# EAGLE design pj13 (EAGLE 7.4.0)
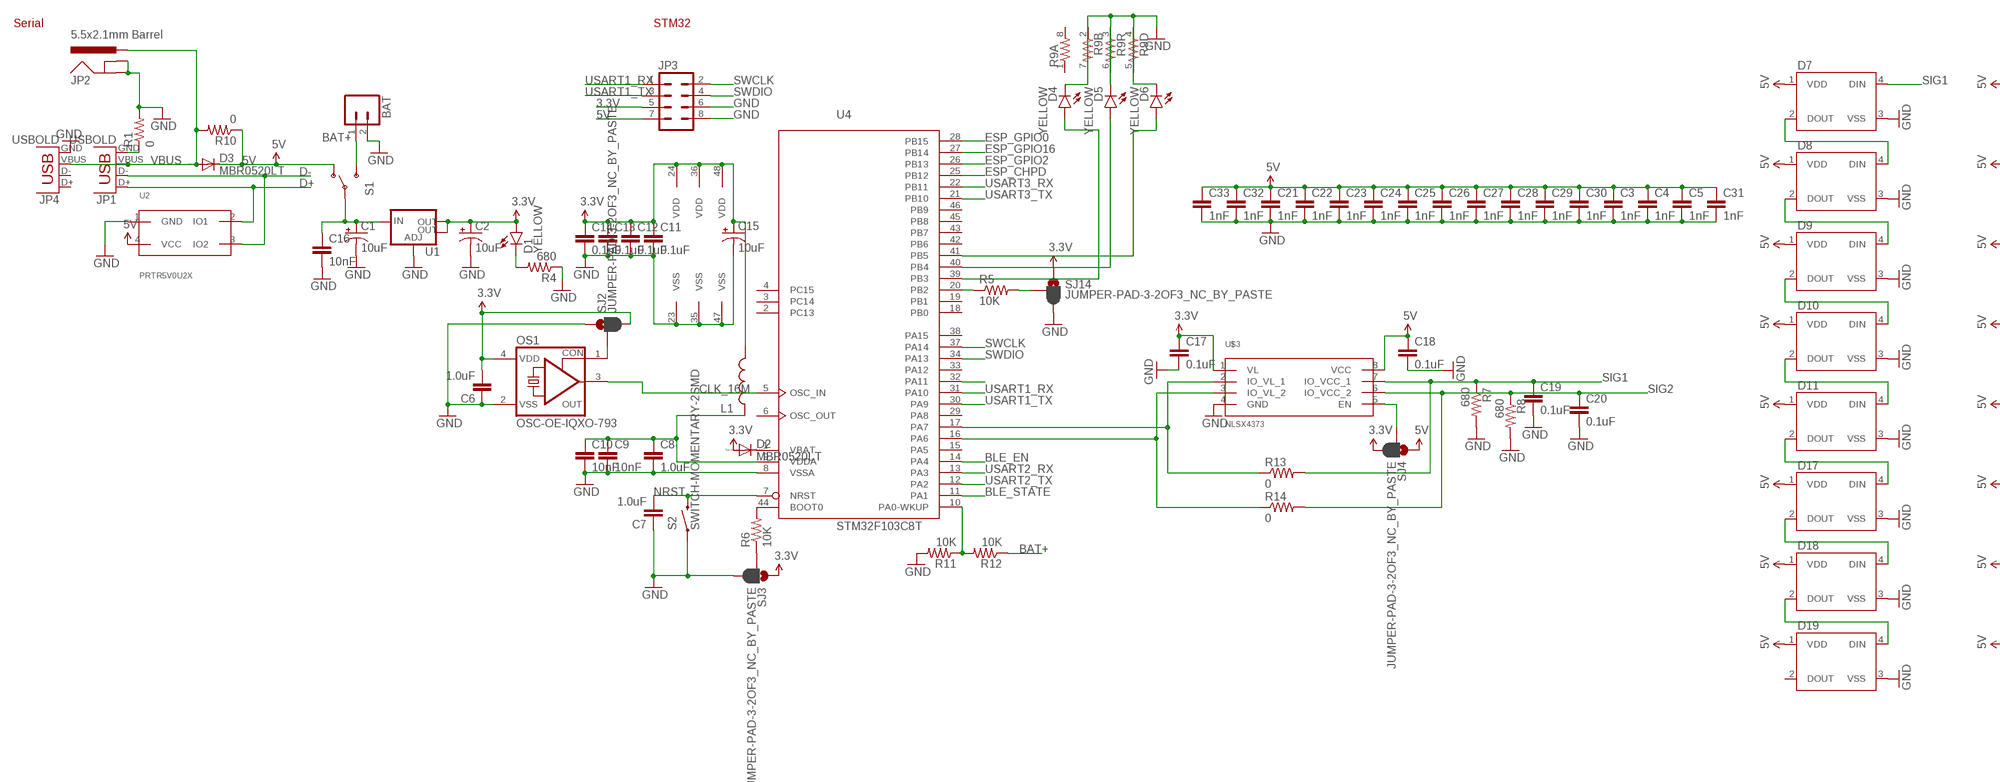
[diagram p0: schematic, sheet 1, part 1 of 2]
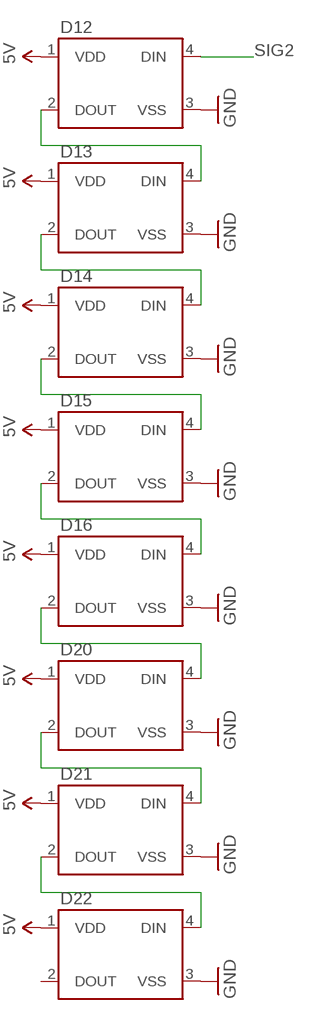
[diagram p1: schematic, sheet 1, part 2 of 2]

## Parts
BAT  M02LOCK  [1X02_LOCK]
C1  10uF  10UF-16V-10%(TANT)  [EIA3216]
C2  10uF  10UF-16V-10%(TANT)  [EIA3216]
C3  1nF  0.1UF-25V-5%(0603)  [0603-CAP]
C4  1nF  0.1UF-25V-5%(0603)  [0603-CAP]
C5  1nF  0.1UF-25V-5%(0603)  [0603-CAP]
C6  1.0uF  1.0UF-16V-10%(0603)  [0603-CAP]
C7  1.0uF  1.0UF-16V-10%(0603)  [0603-CAP]
C8  1.0uF  1.0UF-16V-10%(0603)  [0603-CAP]
C9  10nF  10NF/10000PF-50V-10%(0603)  [0603-CAP]
C10  10nF  10NF/10000PF-50V-10%(0603)  [0603-CAP]
C11  0.1uF  0.1UF-25V-5%(0603)  [0603-CAP]
C12  0.1uF  0.1UF-25V-5%(0603)  [0603-CAP]
C13  0.1uF  0.1UF-25V-5%(0603)  [0603-CAP]
C14  0.1uF  0.1UF-25V-5%(0603)  [0603-CAP]
C15  10uF  10UF-16V-10%(TANT)  [EIA3216]
C16  10nF  10NF/10000PF-50V-10%(0603)  [0603-CAP]
C17  0.1uF  0.1UF-25V-5%(0603)  [0603-CAP]
C18  0.1uF  0.1UF-25V-5%(0603)  [0603-CAP]
C19  0.1uF  0.1UF-25V-5%(0603)  [0603-CAP]
C20  0.1uF  0.1UF-25V-5%(0603)  [0603-CAP]
C21  1nF  0.1UF-25V-5%(0603)  [0603-CAP]
C22  1nF  0.1UF-25V-5%(0603)  [0603-CAP]
C23  1nF  0.1UF-25V-5%(0603)  [0603-CAP]
C24  1nF  0.1UF-25V-5%(0603)  [0603-CAP]
C25  1nF  0.1UF-25V-5%(0603)  [0603-CAP]
C26  1nF  0.1UF-25V-5%(0603)  [0603-CAP]
C27  1nF  0.1UF-25V-5%(0603)  [0603-CAP]
C28  1nF  0.1UF-25V-5%(0603)  [0603-CAP]
C29  1nF  0.1UF-25V-5%(0603)  [0603-CAP]
C30  1nF  0.1UF-25V-5%(0603)  [0603-CAP]
C31  1nF  0.1UF-25V-5%(0603)  [0603-CAP]
C32  1nF  0.1UF-25V-5%(0603)  [0603-CAP]
C33  1nF  0.1UF-25V-5%(0603)  [0603-CAP]
D1  YELLOW  LED-YELLOW1206  [LED-1206]
D2  MBR0520LT  [SOD123]
D3  MBR0520LT  [SOD123]
D4  YELLOW  LED-YELLOW1206  [LED-1206]
D5  YELLOW  LED-YELLOW1206  [LED-1206]
D6  YELLOW  LED-YELLOW1206  [LED-1206]
D7  WS2812B  [WS2812B]
D8  WS2812B  [WS2812B]
D9  WS2812B  [WS2812B]
D10  WS2812B  [WS2812B]
D11  WS2812B  [WS2812B]
D12  WS2812B  [WS2812B]
D13  WS2812B  [WS2812B]
D14  WS2812B  [WS2812B]
D15  WS2812B  [WS2812B]
D16  WS2812B  [WS2812B]
D17  WS2812B  [WS2812B]
D18  WS2812B  [WS2812B]
D19  WS2812B  [WS2812B]
D20  WS2812B  [WS2812B]
D21  WS2812B  [WS2812B]
D22  WS2812B  [WS2812B]
JP1  USBOLD  [USB-MINIB-OLD]
JP2  5.5x2.1mm Barrel  POWER_JACKSMD  [POWER_JACK_SMD]
JP3  M04X2SMD  [2X4_SMD]
JP4  USBOLD  [USB-MINIB-OLD]
L1  INDUCTOR0603  [0603]
OS1  OSC-OE-IQXO-793  [2.5X2-4-PAD]
R1  0  0OHM-1/10W-5%(0603)  [0603]
R4  680  680OHM1/10W5%(0603)  [0603-RES]
R5  10K  10KOHM-1/10W-1%(0603)0603  [0603-RES]
R6  10K  10KOHM-1/10W-1%(0603)0603  [0603-RES]
R7  680  680OHM1/10W5%(0603)  [0603-RES]
R8  680  680OHM1/10W5%(0603)  [0603-RES]
R9  RESISTOR-ARRAY0603-ARV  [0603-ARV]
R10  0  0OHM-1/10W-5%(0603)  [0603]
R11  10K  10KOHM-1/10W-1%(0603)0603  [0603-RES]
R12  10K  10KOHM-1/10W-1%(0603)0603  [0603-RES]
R13  0  680OHM1/10W5%(0603)  [0603-RES]
R14  0  680OHM1/10W5%(0603)  [0603-RES]
S1  SWITCH-SPDTSMD  [AYZ0202]
S2  SWITCH-MOMENTARY-2SMD  [TACTILE-SWITCH-SMD]
SJ2  JUMPER-PAD-3-2OF3_NC_BY_PASTE  [PAD-JUMPER-3-2OF3_NC_BY_PASTE_YES_SILK_FULL_BOX]
SJ3  JUMPER-PAD-3-2OF3_NC_BY_PASTE  [PAD-JUMPER-3-2OF3_NC_BY_PASTE_YES_SILK_FULL_BOX]
SJ4  JUMPER-PAD-3-2OF3_NC_BY_PASTE  [PAD-JUMPER-3-2OF3_NC_BY_PASTE_YES_SILK_FULL_BOX]
SJ14  JUMPER-PAD-3-2OF3_NC_BY_PASTE  [PAD-JUMPER-3-2OF3_NC_BY_PASTE_YES_SILK_FULL_BOX]
U1  V_REG_LM1117SOT223  [SOT223]
U2  PRTR5V0U2X  [SOT143]
U4  STM32F103C8T  [LQFP48]
U$3  NLSX4373  [SO08]

## Nets
3.3V: C2.A(+) C6.2 C11.1 C12.1 C13.1 C14.1 C15.A(+) C17.1 D1.A D2.A JP3.5 L1.2 OS1.4(VDD) SJ2.3 SJ3.1 SJ4.3 SJ14.1 U1.2(OUT) U1.4(OUT) U4.24(VDD) U4.36(VDD) U4.48(VDD) U$3.1(VL)
5V: C3.1 C4.1 C5.1 C18.1 C21.1 C22.1 C23.1 C24.1 C25.1 C26.1 C27.1 C28.1 C29.1 C30.1 C31.1 C32.1 C33.1 D3.C D7.1(VDD) D8.1(VDD) D9.1(VDD) D10.1(VDD) D11.1(VDD) D12.1(VDD) D13.1(VDD) D14.1(VDD) D15.1(VDD) D16.1(VDD) D17.1(VDD) D18.1(VDD) D19.1(VDD) D20.1(VDD) D21.1(VDD) D22.1(VDD) JP3.7 R10.1 S1.1(O) SJ4.1 U2.4(VCC) U$3.8(VCC)
BAT+: BAT.1 R12.1 S1.3(S)
BLE_EN: U4.14(PA4)
BLE_STATE: U4.11(PA1)
CLK_16M: OS1.3(OUT) U4.5(OSC_IN)
D+: JP1.D+ U2.2(IO1)
D-: JP1.D- U2.3(IO2)
ESP_CHPD: U4.25(PB12)
ESP_GPIO0: U4.28(PB15)
ESP_GPIO2: U4.26(PB13)
ESP_GPIO16: U4.27(PB14)
GND: BAT.2 C1.C(-) C2.C(-) C3.2 C4.2 C5.2 C6.1 C7.1 C8.2 C9.2 C10.2 C11.2 C12.2 C13.2 C14.2 C15.C(-) C16.2 C17.2 C18.2 C19.2 C20.2 C21.2 C22.2 C23.2 C24.2 C25.2 C26.2 C27.2 C28.2 C29.2 C30.2 C31.2 C32.2 C33.2 D7.3(VSS) D8.3(VSS) D9.3(VSS) D10.3(VSS) D11.3(VSS) D12.3(VSS) D13.3(VSS) D14.3(VSS) D15.3(VSS) D16.3(VSS) D17.3(VSS) D18.3(VSS) D19.3(VSS) D20.3(VSS) D21.3(VSS) D22.3(VSS) JP2.GND(GNDBREAK) JP2.P$4(GND) JP3.6 JP3.8 JP4.GND OS1.2(VSS) R1.2 R4.1 R7.2 R8.2 R9.5 R9.6 R9.7 R11.2 S2.1 SJ2.1 SJ3.3 SJ14.3 U1.1(ADJ) U2.1(GND) U4.8(VSSA) U4.23(VSS) U4.35(VSS) U4.47(VSS) U$3.4(GND)
N$1: JP1.GND R1.1
N$2: D11.2(DOUT) D17.4(DIN)
N$3: D1.C R4.2
N$4: D2.C U4.1(VBAT)
N$5: R11.1 R12.2 U4.10(PA0-WKUP)
N$6: C8.1 C9.1 C10.1 L1.1 U4.9(VDDA)
N$7: R6.2 U4.44(BOOT0)
N$8: D6.A U4.41(PB5)
N$9: R6.1 SJ3.2
N$10: D17.2(DOUT) D18.4(DIN)
N$11: OS1.1(CON) SJ2.2
N$13: D5.A U4.40(PB4)
N$14: SJ4.2 U$3.5(EN)
N$15: D18.2(DOUT) D19.4(DIN)
N$16: D4.A U4.39(PB3)
N$17: D4.C R9.2
N$18: D5.C R9.3
N$19: D6.C R9.4
N$20: C1.A(+) C16.1 S1.2(P) U1.3(IN)
N$24: D12.2(DOUT) D13.4(DIN)
N$25: D13.2(DOUT) D14.4(DIN)
N$26: R13.1 U4.17(PA7) U$3.2(IO_VL_1)
N$27: R14.1 U4.16(PA6) U$3.3(IO_VL_2)
N$28: D7.2(DOUT) D8.4(DIN)
N$29: D8.2(DOUT) D9.4(DIN)
N$30: D9.2(DOUT) D10.4(DIN)
N$31: D10.2(DOUT) D11.4(DIN)
N$32: D14.2(DOUT) D15.4(DIN)
N$33: D15.2(DOUT) D16.4(DIN)
N$34: D16.2(DOUT) D20.4(DIN)
N$35: D20.2(DOUT) D21.4(DIN)
N$36: D21.2(DOUT) D22.4(DIN)
N$48: R5.2 SJ14.2
NRF_CSN: U4.32(PA11)
NRST: C7.2 S2.3 U4.7(NRST)
OURET: R5.1 U4.20(PB2)
SIG1: C19.1 D7.4(DIN) R7.1 R13.2 U$3.7(IO_VCC_1)
SIG2: C20.1 D12.4(DIN) R8.1 R14.2 U$3.6(IO_VCC_2)
SWCLK: JP3.2 U4.37(PA14)
SWDIO: JP3.4 U4.34(PA13)
USART1_RX: JP3.1 U4.31(PA10)
USART1_TX: JP3.3 U4.30(PA9)
USART2_RX: U4.13(PA3)
USART2_TX: U4.12(PA2)
USART3_RX: U4.22(PB11)
USART3_TX: U4.21(PB10)
VBUS: D3.A JP1.VBUS JP2.VIN0(PWR) JP4.VBUS R10.2
Unconnected: D19.2(DOUT) D22.2(DOUT) JP4.D+ JP4.D- R9.1 R9.8 U4.2(PC13) U4.3(PC14) U4.4(PC15) U4.6(OSC_OUT) U4.15(PA5) U4.18(PB0) U4.19(PB1) U4.29(PA8) U4.33(PA12) U4.38(PA15) U4.42(PB6) U4.43(PB7) U4.45(PB8) U4.46(PB9)

## Notes on the sheet
- Serial | STM32

## Library data of the parts
BAT = SparkFun-Connectors:M02: Standard 2-pin 0.1" header. Use with - straight break away headers ( PRT-00116) - right angle break away headers (PRT-00553) - swiss pins (PRT-00743) - machine pins (PRT-00117) - female headers (PRT-00115) Molex polarized connector foot print use with: PRT-08233 with associated crimp pins and housings. 2.54_SCREWTERM for use with PRT-10571. 3.5mm Screw Terminal footprints for PRT-08084 5mm Screw Terminal footprints for use with PRT-08432
C1 C2 C15 = SparkFun-Capacitors:10UF-16V-10%(TANT): CAP-00811 1206/EIA-3216 Tantalum capacitor; PROD_ID: CAP-00811
C3-C5 C21-C33 = SparkFun-Capacitors:0.1UF-25V-5%(0603): CAP-08604; PROD_ID: CAP-08604; VALUE: 0.1uF
C6-C8 = SparkFun-Capacitors:1.0UF-16V-10%(0603): CAP-00868; PROD_ID: CAP-00868
C9 C10 C16 = SparkFun-Capacitors:10NF/10000PF-50V-10%(0603): CAP-00867; PROD_ID: CAP-00867
C11-C14 C17-C20 = SparkFun-Capacitors:0.1UF-25V-5%(0603): CAP-08604; PROD_ID: CAP-08604
D1 D4-D6 = SparkFun-LED:LED-YELLOW: Yellow SMD LEDs LilyPad 1206- DIO-09909 0603- DIO-09003 "SMART" means more efficient and expensive; PROD_ID: DIO-00820
D2 D3 = diode:MBR0520LT: SCHOTTKY BARRIER RECTIFIER Source: http://onsemi.com .. MBR0520LT1-D.pdf
D7-D22 = SparkFun-LED:WS2812B: WS2812B - Intelligent control LED integrated light source Technical Specifications: Power Supply Voltage (VDD): 3.5 to 5.3 V Input Voltage (VI): -0.5 to VDD+0.5 V Operating Junction Temperature (Topt): -25°C to +80°C Storage Temperature Range (Tstg): -55°C to +150°C; PROD_ID: DIO-12503
JP1 JP4 = SparkFun-Connectors:USB: USB Connectors USB-B-PTH is fully proven SKU : PRT-00139/CONN-08278 USB-miniB is fully proven SKU : PRT-00587 USB-A-PCB is untested. USB-A-H is throughly reviewed, but untested. Spark Fun Electronics SKU : PRT-00437 USB-B-SMT is throughly reviewed, but untested. Needs silkscreen touching up. USB-A-S has not been used/tested USB-MB-H has not been used/tested USB-MICROB has been used. CONN-09505
JP2 = SparkFun-Connectors:POWER_JACK: Power Jack This is the standard 5.5mm barrel jack for power. The PTH is the most common, proven, reliable, footprint. The Slot footprint only works if the mill layer is transmitted to the PCB fab house so be warned. Mating wall wart : TOL-00298 (and others); PROD_ID: CONN-08106; SF_ID: PRT-12748
JP3 = SparkFun-Connectors:M04X2: .1" header, two rows of four.
L1 = SparkFun-Passives:INDUCTOR: Inductors Basic Inductor/Choke - 0603 and 1206. Footprints are not proven and vary greatly between part numbers. INDUCTOR POWER 3.3UH 4.0A SMD 0.197" L x 0.197" W x 0.177" H (5.00mm x 5.00mm x 4.50mm)
OS1 = IQD-Frequency-Products:OSC-OE: OSCILLATOR WITH OE
R1 R10 = SparkFun-Resistors:0OHM-1/10W-5%(0603): RES-08609; PROD_ID: RES-08609
R4 R7 R8 = SparkFun-Resistors:680OHM1/10W5%(0603): RES-09333; PROD_ID: RES-09333
R5 R6 R11 R12 = SparkFun-Resistors:10KOHM-1/10W-1%(0603): RES-00824; PROD_ID: RES-00824
R9 = SparkFun-Resistors:RESISTOR-ARRAY: Array Chip Resistor Source: RS Component / Phycomp
R13 R14 = SparkFun-Resistors:680OHM1/10W5%(0603): RES-09333; PROD_ID: RES-09333; VALUE: 680
S1 = SparkFun-Electromechanical:SWITCH-SPDT: SPDT Switch Simple slide switch, Spark Fun Electronics SKU : COM-00102 DPDT SMT slide switch, AYZ0202, SWCH-08179; PROD_ID: SWCH-08179; SF_ID: COM-00597
S2 = SparkFun-Electromechanical:SWITCH-MOMENTARY-2: Various NO switches- pushbuttons, reed, etc; PROD_ID: SWCH-08247
SJ2-SJ4 SJ14 = SparkFun-Passives:JUMPER-PAD-3-2OF3_NC_BY_PASTE
U1 = SparkFun-PowerIC:V_REG_LM1117: Voltage Regulator LM1117 Standard adjustable voltage regulator but in SMD form. Spark Fun Electronics SKU : COM-00595; PROD_ID: VREG-08170
U2 = semicon-smd-ipc:PRTR5V0U2X
U4 = micro-stm_v3:STM32F103C*T: ARM 32-bit Cortex™-M3 CPU 72 MHz maximum frequency 16 to 128 Kbytes of Flash memory 6 to 20 kbytes of SRAM 37 GPIOs 2.0 to 3.6 V application supply
U$3 = SparkFun-DigitalIC:NLSX4373

## Board
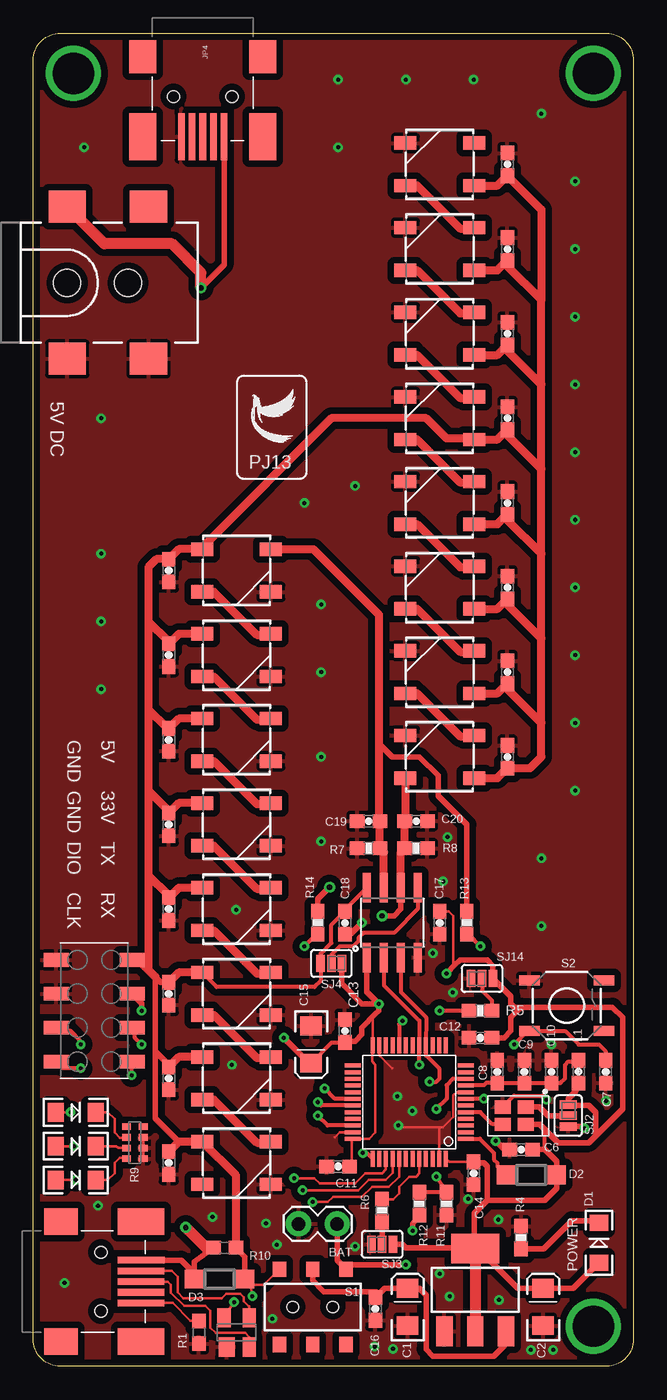
[diagram p2: board, top side]
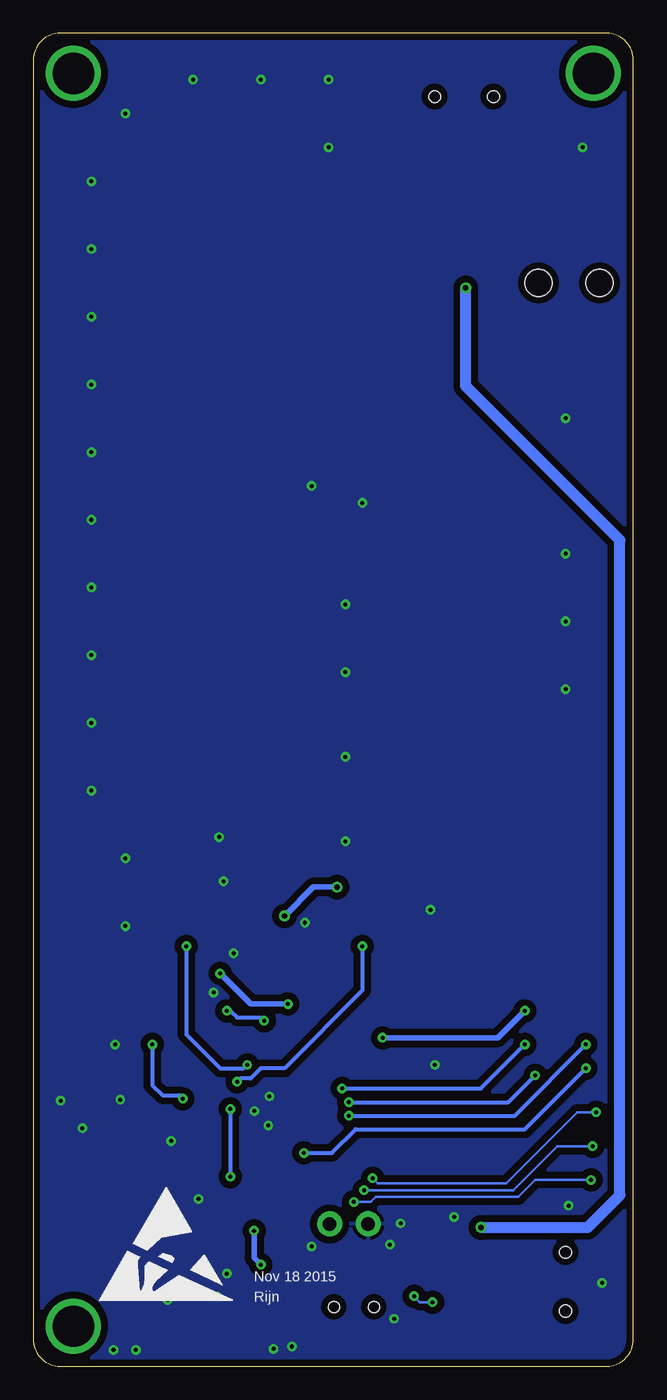
[diagram p3: board, bottom side, seen from below]

Size 45 x 100 mm. Coordinates in mm from the lower left corner, seen from the top.
Outline: 43,0 2,0 arc-90 0,2 0,98 arc-90 2,100 43,100 arc-90 45,98 45,2 arc-90 43,0
Copper layers (1*16): Top 0.035mm / dielectric 1.5mm / Bottom 0.035mm
Design rules "default *": minimum track width 6mil, minimum drill 12mil, track to track 6mil, track to pad 6mil, pad to pad 6mil, via to via 6mil, smd to smd 6mil, copper to edge 5mil, drill to drill 6mil, minimum pad ring 10mil, minimum via ring 8mil, stop-mask expansion 0mil, vias tented up to drill 12mil, thermal gap 10mil

### Footprints (pad centres in the part's own frame; a part is rotated, then mirrored left to right if it is on the bottom)
1X02_LOCK = drill 1.016 pad 1.88: 1 -0.178,0; 2 2.718,0
EIA3216 = smd 1.4 x 1.6: A 1.4,0; C -1.4,0
0603-CAP = smd 1.1 x 1: 1 -0.85,0; 2 0.85,0
LED-1206 = smd 1.2 x 1.4: A -1.5,0; C 1.5,0
SOD123 = smd 1.4 x 1.4: A 1.9,0; C -1.9,0
WS2812B = smd 1.651 x 1: 1 -2.577,1.6; 2 -2.577,-1.6; 3 2.577,-1.6; 4 2.577,1.6
USB-MINIB-OLD = smd 2.5 x 2: 1 -3,-4.5; 2 -3,4.5 | smd 3.5 x 2: 3 3,-4.5; 4 3,4.5 | smd 3.5 x 0.5: D+ 3,0; D- 3,0.8; GND 3,-1.6; ID 3,-0.8; VBUS 3.01,1.61 | hole 0.9: 0,2.2; 0,-2.2
POWER_JACK_SMD = smd 2.8 x 2.4: GND 0,-5.7; P$4 6.1,-5.7; VIN0 0,5.7; VIN1 6.1,5.7 | hole 2.032: 0,0; 4.572,0
2X4_SMD = smd 1.02 x 1.9: 1 -2.54,-2.85; 2 -2.54,2.85; 3 0,-2.85; 4 0,2.85; 5 2.54,-2.85; 6 2.54,2.85; 7 5.08,-2.85; 8 5.08,2.85
0603 = smd 1.1 x 1: 1 -0.85,0; 2 0.85,0
2.5X2-4-PAD = smd 1.2 x 1: 1 -0.85,-0.65; 2 0.85,-0.65; 3 0.85,0.65; 4 -0.85,0.65
0603-RES = smd 1.1 x 1: 1 -0.85,0; 2 0.85,0
0603-ARV = smd 0.5 x 0.65: 1 -1.2,-0.625; 2 -0.4,-0.625; 3 0.4,-0.625; 4 1.2,-0.625; 5 1.2,0.625; 6 0.4,0.625; 7 -0.4,0.625; 8 -1.2,0.625
AYZ0202 = smd 1 x 1.15: 1 -2.5,2.825; 2 0,2.825; 3 2.5,2.825; 4 -2.5,-2.825; 5 0,-2.825; 6 2.5,-2.825 | hole 0.85: 1.5,0; -1.5,0
TACTILE-SWITCH-SMD = smd 1.524 x 0.762: 1 -2.794,1.905; 2 2.794,1.905; 3 -2.794,-1.905; 4 2.794,-1.905
PAD-JUMPER-3-2OF3_NC_BY_PASTE_YES_SILK_FULL_BOX = smd 0.635 x 1.27: 1 -0.813,0; 2 0,0; 3 0.813,0
SOT223 = smd 1.219 x 2.235: 1 -2.311,-3.099; 2 0,-3.099; 3 2.311,-3.099 | smd 3.6 x 2.2: 4 0,3.099
SOT143 = smd 1.2 x 1.44: 1 -0.75,-1.1 | smd 1 x 1.44: 2 0.95,-1.1; 3 0.95,1.1; 4 -0.95,1.1
LQFP48 = smd 0.3 x 1.2: 1 -2.75,-4.25; 2 -2.25,-4.25; 3 -1.75,-4.25; 4 -1.25,-4.25; 5 -0.75,-4.25; 6 -0.25,-4.25; 7 0.25,-4.25; 8 0.75,-4.25; 9 1.25,-4.25; 10 1.75,-4.25; 11 2.25,-4.25; 12 2.75,-4.25; 25 2.75,4.25; 26 2.25,4.25; 27 1.75,4.25; 28 1.25,4.25; 29 0.75,4.25; 30 0.25,4.25; 31 -0.25,4.25; 32 -0.75,4.25; 33 -1.25,4.25; 34 -1.75,4.25; 35 -2.25,4.25; 36 -2.75,4.25 | smd 1.2 x 0.3: 13 4.25,-2.75; 14 4.25,-2.25; 15 4.25,-1.75; 16 4.25,-1.25; 17 4.25,-0.75; 18 4.25,-0.25; 19 4.25,0.25; 20 4.25,0.75; 21 4.25,1.25; 22 4.25,1.75; 23 4.25,2.25; 24 4.25,2.75; 37 -4.25,2.75; 38 -4.25,2.25; 39 -4.25,1.75; 40 -4.25,1.25; 41 -4.25,0.75; 42 -4.25,0.25; 43 -4.25,-0.25; 44 -4.25,-0.75; 45 -4.25,-1.25; 46 -4.25,-1.75; 47 -4.25,-2.25; 48 -4.25,-2.75
SO08 = smd 0.61 x 2.21: 1 -1.905,-2.616; 2 -0.635,-2.616; 3 0.635,-2.616; 4 1.905,-2.616; 5 1.905,2.616; 6 0.635,2.616; 7 -0.635,2.616; 8 -1.905,2.616

### Placement (x,y rotation side)
BAT  22.61,10.67 180 top
C1  28.07,4.45 90 top
C2  38.23,4.45 90 top
C3  10.16,46.99 270 top
C4  10.16,40.64 270 top
C5  10.16,34.29 270 top
C6  36.58,16.26 0 top
C7  42.93,22.1 90 top
C8  34.8,22.1 90 top
C9  36.83,22.1 90 top
C10  38.86,22.1 90 top
C11  22.86,14.99 180 top
C12  33.53,24.64 180 top
C13  23.37,25.15 90 top
C14  33.02,14.48 270 top
C15  20.83,24.13 270 top
C16  25.65,4.29 270 top
C17  30.48,33.27 270 top
C18  23.37,33.27 270 top
C19  25.15,40.89 180 top
C20  28.7,40.89 0 top
C21  35.56,90.17 90 top
C22  35.56,83.82 90 top
C23  35.56,77.47 90 top
C24  35.56,71.12 90 top
C25  35.56,64.77 90 top
C26  35.56,58.42 90 top
C27  35.56,45.72 90 top
C28  35.56,52.07 90 top
C29  10.16,53.34 270 top
C30  10.16,59.69 270 top
C31  10.16,27.94 270 top
C32  10.16,21.59 270 top
C33  10.16,15.24 270 top
D1  42.42,9.27 90 top
D2  37.34,14.35 0 top
D3  13.97,6.53 180 top
D4  3.17,19.05 0 top
D5  3.17,16.51 0 top
D6  3.17,13.97 0 top
D7  15.24,59.69 0 top
D8  15.24,53.34 0 top
D9  15.24,46.99 0 top
D10  15.24,40.64 0 top
D11  15.24,34.29 0 top
D12  30.48,45.72 180 top
D13  30.48,52.07 180 top
D14  30.48,58.42 180 top
D15  30.48,64.77 180 top
D16  30.48,71.12 180 top
D17  15.24,27.94 0 top
D18  15.24,21.59 0 top
D19  15.24,15.24 0 top
D20  30.48,77.47 180 top
D21  30.48,83.82 180 top
D22  30.48,90.17 180 top
JP1  5.08,6.35 0 top
JP2  2.54,81.28 0 top
JP3  4.57,25.4 90 top
JP4  12.7,95.25 270 top
L1  40.89,22.1 270 top
OS1  36.07,18.8 180 top
R1  12.42,2.54 270 top
R4  36.58,9.65 270 top
R5  33.53,26.67 0 top
R6  26.16,11.68 90 top
R7  25.15,38.86 180 top
R8  28.7,38.86 0 top
R9  7.62,16.76 270 top
R10  14.35,8.89 180 top
R11  30.99,12.19 270 top
R12  28.96,12.19 90 top
R13  32.51,33.27 90 top
R14  21.34,33.27 90 top
S1  20.95,4.45 0 top
S2  40.01,27.05 0 top
SJ2  40.13,18.8 90 top
SJ3  26.16,9.14 180 top
SJ4  22.35,30.23 0 top
SJ14  33.66,29.08 180 top
U1  33.15,5.71 0 top
U2  15.24,2.54 0 top
U4  28.19,19.81 90 top
U$1  [LOGO]  16.33,69.29 0 top
U$2  [ESD_10.00]  40.13,4.83 0 bottom
U$3  26.92,33.27 0 top

### Tracks (layer width: path | path; a pad name or v marks a point on that pad's centre or on a via)
3.3V  (via drill 0.3)
  Top 0.203: C14.1 31.18,15.33 U4.48 | 25.65,26.42 25.44,26.21 U4.24 25.4,24.02 25.4,22.86 25.65,22.61 25.65,17.53 25.19,17.06 U4.36 23.88,16.99 23.88,14.99 | C17.1 31.15,34.12 31.5,33.78 31.5,30.23 31.62,30.1
  Top 0.305: 23.37,24.26 22.36,24.26 C15.A | 38.35,16.26 38.35,17.78 38.1,18.03
  Top 0.406: SJ3.1 27.69,9.14 27.94,8.89 33.07,8.89 | 33.07,8.89 U1.4 33.35,8.81 36.32,5.84 C2.A 40.49,5.84 D1.A | 33.07,8.89 33.07,11.48 34.04,12.45 | 34.04,12.45 34.04,14.99 33.78,15.24 33.11,15.24 C14.1 | 34.04,12.45 38.35,12.45 39.24,13.33 D2.A 39.24,15.37 38.35,16.26 C6.2 | OS1.4 37.99,18.15 38.1,18.03 39.37,16.76 41.66,16.76 42.16,17.27 | 42.16,17.27 42.16,19.05 41.66,19.56 40.18,19.56 SJ2.3 40.13,20.07 40.64,20.57 L1.2 | C12.1 35.31,24.64 35.81,25.15 35.81,26.16 36.58,26.92 | 36.58,26.92 43.43,26.92 44.2,26.16 44.2,19.3 42.16,17.27 | 36.58,26.92 36.07,26.92 35.81,27.18 35.81,27.74 SJ14.1 34.47,30.05 34.04,30.48 32,30.48 31.62,30.1 v30.99,29.46 | v25.91,27.18 24.64,27.18 23.11,28.7 23.11,30.18 SJ4.3 | v25.91,27.18 25.91,26.67 25.65,26.42 24.64,25.4 24.64,24.89 24.13,24.38 23.46,24.38 C13.1 23.37,24.26 | C11.1 23.88,14.99 | U$3.1 25.02,28.07 v25.91,27.18 | C15.A 20.7,22.73 v18.8,24.64 | v8.13,26.67 8.13,27.23 JP3.5
  Top 0.813: U1.4 U1.2
  Bottom 0.406: v30.99,29.46 28.7,27.18 v25.91,27.18 | v18.8,24.64 10.16,24.64 v8.13,26.67
5V  (via drill 0.3)
  Top 0.203: U2.4 14.29,3.72 v15.06,4.8 | 16.31,5.91 D3.C 16.31,6.09 | v16.43,5.26 16.31,6.09 | 16.31,6.09 17.28,6.09 S1.1
  Top 0.305: U$3.8 23.37,34.24 C18.1 22.35,33.11 22.35,31.75 21.54,30.94 SJ4.1 21.54,28.91 21.08,28.45 13.76,28.45 D17.1 | D16.1 33.06,69.56 33.02,69.6 | 12.7,61.47 12.7,61.33 D7.1
  Top 0.406: D3.C 15.87,8.22 R10.1 | 9.14,29.21 9.14,23.62 | 9.14,23.62 9.14,18.61 10.91,16.84 | C32.1 10.16,22.61 9.14,23.62 | C31.1 9.56,28.79 8.89,29.46
  Top 0.61: D7.1 10.91,61.29 C30.1 9.23,60.54 8.64,59.94 8.64,55.88 | D8.1 10.91,54.94 C29.1 10.16,54.36 8.64,55.88 | D9.1 10.91,48.59 C3.1 10.07,47.84 8.64,49.28 | D10.1 10.91,42.24 C4.1 10.16,41.66 8.64,43.18 | D11.1 10.91,35.89 C5.1 10.16,35.31 8.64,36.83 | D17.1 10.91,29.54 C31.1 | D18.1 10.91,23.19 C32.1 | C33.1 10.91,16.84 D19.1 15.2,14.3 R10.1 | 8.64,55.88 8.64,49.28 | 8.64,49.28 8.64,43.18 | 8.64,43.18 8.64,36.83 | 8.64,36.83 8.64,29.72 | 8.64,29.72 8.89,29.46 9.14,29.21 | JP3.7 7.87,30.48 8.64,29.72 | 38.1,48.26 38.1,45.72 37.25,44.87 C27.1 34.81,44.12 D12.1 | 38.1,48.26 38.1,54.61 | 38.1,54.61 38.1,60.96 | 38.1,60.96 38.1,67.31 | 38.1,67.31 38.1,73.66 | 38.1,73.66 38.1,80.01 | 38.1,80.01 38.1,86.78 C21.1 34.81,88.57 D22.1 | 38.1,80.01 35.56,82.55 C22.1 34.81,82.22 D21.1 | 38.1,73.66 35.56,76.2 C23.1 34.81,75.87 D20.1 | 38.1,67.31 35.56,69.85 C24.1 34.81,69.52 D16.1 | 38.1,60.96 35.56,63.5 C25.1 34.81,63.17 D15.1 | 38.1,54.61 35.56,57.15 C26.1 34.81,56.82 D14.1 | 38.1,48.26 35.56,50.8 C28.1 34.81,50.47 D13.1 | 33.02,69.6 30.99,69.6 29.46,71.12 22.35,71.12 12.7,61.47
  Bottom 0.203: v15.06,4.8 16,4.8 v16.43,5.26
BAT+  (via drill 0.3)
  Top 0.406: BAT.1 22.78,7.94 S1.3 23.8,7.62 v27.94,7.62 | R12.1 28.45,10.67 v28.45,10.16
  Bottom 0.406: v28.45,10.16 28.45,8.13 v27.94,7.62
CLK_16M
  Top 0.305: OS1.3 34.43,18.15 33.53,19.05 32.46,19.05 U4.5
D+
  Top 0.203: JP1.D+ 10.08,6.35 10.31,6.12 10.31,5.51 11.3,4.52 12.9,4.52 13.28,4.14 13.28,2.87 13.66,2.49 15.9,2.49 16.2,2.18 16.2,1.46 U2.2
D-
  Top 0.203: JP1.D- 10.38,7.15 10.82,6.71 10.82,5.54 11.25,5.11 14.15,5.11 14.48,5.44 15.52,5.44 15.77,5.18 15.77,4.88 16.15,4.5 16.18,4.5 U2.3
GND  (via drill 0.3)
  Top 0.203: R9.7 R9.6 R9.5 | U4.8 31.74,20.56 31.5,20.32 31.5,18.72 30.71,17.93 30.38,17.93 | 30.38,17.93 27.51,17.93 v27.38,18.06 | U4.47 30.44,17.87 30.38,17.93 | U4.23 25.94,23.31 26.92,22.33 | U4.35 23,17.56 22.61,17.17 | OS1.2 35.22,19.47
  Top 0.305: 35.22,19.47 36.04,20.3 38.18,20.3 v38.48,19.99
  Top 0.406: C18.2 23.79,32.42 v24.64,33.27 | SJ2.1 41.1,17.98 v41.33,17.86 | C6.1 35.31,16.26 v34.67,16.89
  other vias: 29.97,30.99 38.1,33.02 38.1,38.1 40.64,43.18 40.64,48.26 40.64,53.34 40.64,58.42 40.64,63.5 40.64,68.58 40.64,73.66 40.64,78.74 40.64,83.82 40.64,88.9 38.1,93.98 33.02,96.52 27.94,96.52 22.86,96.52 22.86,91.44 38.86,24.13 42.95,19.91 32.61,12.55 34.87,11 24.13,8.99 17.45,10.72 14.88,22.61 4.85,12.04 13.44,11.2 2.34,6.25 27.3,20.24 28.42,19.15 15.21,34.24 21.59,39.37 21.59,45.72 21.59,52.07 21.59,57.15 20.32,64.77 24.13,66.04 5.08,71.12 3.81,91.44 5.08,60.96 5.08,55.88 5.08,50.8 25.6,1.47 26.97,1.3 31.22,5.23 30.48,6.93 37.31,1.22 38.99,1.22 34.92,4.98 17.93,3.56 18.26,9.12 30.73,36.37 31.06,39.7 31.47,28.04
  pour Top (isolate 0.508): -2.54,114.3 48.26,114.3 48.26,-2.54 -2.54,-2.54
  pour Bottom (isolate 0.508): -10.16,106.68 50.8,106.68 50.8,-2.54 -10.16,-2.54
N$1
  Top 0.203: JP1.GND 10.44,4.75 11.79,3.4 12.41,3.4 R1.1
N$2
  Top 0.61: D11.2 13.54,32.69 16.76,29.46 17.89,29.46 | 18.29,29.46 17.89,29.46 | 17.89,29.46 D17.4
N$3
  Top 0.406: R4.2 38.27,8.8 40.39,10.92 42.27,10.92 D1.C
N$4
  Top 0.305: U4.1 33.48,17.06 34.54,16 34.54,15.49 34.8,15.24 34.8,14.99 D2.C
N$5  (via drill 0.3)
  Top 0.305: U4.10 31.47,21.56 30.99,21.08 30.99,20.07 v30.23,19.3 | v30.23,14.22 R11.1 R12.2
  Bottom 0.305: v30.23,19.3 v30.23,14.22
N$6
  Top 0.305: U4.9 32.46,21.08 33.78,21.08 33.95,21.25 C8.1 C9.1 C10.1 39.54,21.25 39.88,21.59 39.88,22.61 40.13,22.86 40.81,22.86 L1.1
N$7
  Top 0.203: R6.2 27.01,12.53 27.43,12.95 27.43,13.46 28.19,14.22 28.7,14.22 28.96,14.48 28.96,15.55 U4.44
N$8  (via drill 0.3)
  Top 0.203: U4.41 27.44,15.51 27.43,15.49 27.43,14.22 26.67,13.46 25.4,13.46 24.64,12.7 22.48,12.7 22.1,12.32 v20.95,12.32 | D6.A v3.17,13.97
  Bottom 0.203: v3.17,13.97 7.37,13.97 8.64,12.7 19.3,12.7 19.68,12.32 v20.95,12.32
N$9
  Top 0.406: R6.1 SJ3.2
N$10
  Top 0.61: D17.2 13.54,26.34 16.76,23.11 17.74,23.11 D18.4
N$11
  Top 0.406: OS1.1 37.96,19.45 38.61,18.8 SJ2.2
N$12  (via drill 3.1)
  other vias: 42,3
N$13  (via drill 0.3)
  Top 0.203: U4.40 26.94,14.5 26.42,13.97 25.15,13.97 24.38,13.21 v20.19,13.21 | D5.A v3.05,16.51
  Bottom 0.203: v3.05,16.51 5.71,16.51 9.02,13.21 v20.19,13.21
N$14
  Top 0.305: U$3.5 28.83,34.29 27.05,32.51 24.77,32.51 24.38,32.13 24.38,31.88 24,31.5 22.99,31.5 22.35,30.86 SJ4.2
N$15
  Top 0.61: D18.2 13.54,19.99 16.76,16.76 17.74,16.76 D19.4
N$16  (via drill 0.3)
  Top 0.203: U4.39 26.44,14.76 26.16,14.48 24.89,14.48 24.13,13.72 21.46,13.72 21.08,14.1 v19.56,14.1 | D4.A v2.79,19.05
  Bottom 0.203: v2.79,19.05 4.19,19.05 9.53,13.72 19.18,13.72 v19.56,14.1
N$17
  Top 0.203: D4.C 5.59,19.05 6.1,18.54 6.1,17.53 6.48,17.14 6.98,17.14 R9.2
N$18
  Top 0.203: D5.C 6.22,16.51 6.35,16.38 6.98,16.38 R9.3
N$19
  Top 0.203: D6.C 5.59,13.97 6.1,14.48 6.1,15.24 6.48,15.62 6.94,15.62 R9.4
N$20
  Top 0.406: S1.2 20.95,6.43 21.79,5.59 25.72,5.59 C16.1 26.36,5.84 C1.A 28.95,5.84 29.46,5.33 29.46,1.27 29.97,0.76 34.54,0.76 35.31,1.52 35.31,2.46 U1.3
N$21  (via drill 3.1)
  other vias: 42,97
N$22  (via drill 3.1)
  other vias: 3,97
N$24
  Top 0.61: D13.4 28.78,50.47 32,47.24 32.98,47.24 D12.2
N$25
  Top 0.61: D14.4 28.78,56.82 32,53.59 32.98,53.59 D13.2
N$26  (via drill 0.3)
  Top 0.305: R13.1 32.6,32.42 v33.53,31.5 | v28.96,22.61 28.96,24.05 U4.17 28.96,24.07 28.96,25.91 26.29,28.57 U$3.2
  Bottom 0.305: v33.53,31.5 33.53,24.89 30.99,22.35 29.21,22.35 v28.96,22.61
N$27  (via drill 0.3)
  Top 0.305: R14.1 21.25,32.42 v20.32,31.5 | v29.72,21.34 30.23,21.34 30.48,21.59 30.48,22.3 29.46,23.32 29.46,24.04 U4.16 29.46,26.16 27.56,28.07 U$3.3
  Bottom 0.305: v20.32,31.5 20.32,28.19 26.16,22.35 27.94,22.35 28.7,21.59 29.46,21.59 v29.72,21.34
N$28
  Top 0.61: D7.2 13.54,58.09 16.76,54.86 17.74,54.86 D8.4
N$29
  Top 0.61: D8.2 13.54,51.74 16.76,48.51 17.74,48.51 D9.4
N$30
  Top 0.61: D9.2 13.54,45.39 16.76,42.16 17.74,42.16 D10.4
N$31
  Top 0.61: D10.2 13.54,39.04 16.76,35.81 17.74,35.81 D11.4
N$32
  Top 0.61: D15.4 28.78,63.17 32,59.94 32.98,59.94 D14.2
N$33
  Top 0.61: D16.4 28.78,69.52 32,66.29 32.98,66.29 D15.2
N$34
  Top 0.61: D20.4 28.78,75.87 32,72.64 32.98,72.64 D16.2
N$35
  Top 0.61: D21.4 28.78,82.22 32,78.99 32.98,78.99 D20.2
N$36
  Top 0.61: D22.4 28.78,88.57 32,85.34 32.98,85.34 D21.2
N$48
  Top 0.305: SJ14.2 33.66,28.17 34.39,27.43 34.39,26.68 R5.2
NRST  (via drill 0.3)
  Top 0.305: C7.2 42.93,23.62 42.42,24.13 40.89,24.13 39.88,25.15 S2.3 37.08,25.15 v36.07,24.13 | v33.78,20.07 U4.7 | 32,20.07 U4.7 | U4.7
  Bottom 0.305: v36.07,24.13 36.07,21.08 35.31,20.32 34.04,20.32 v33.78,20.07
OURET  (via drill 0.3)
  Top 0.305: R5.1 v30.48,26.67 | v27.69,25.91 27.43,25.65 27.43,24.07 U4.20
  Bottom 0.305: v30.48,26.67 30.23,26.67 29.72,26.16 27.94,26.16 v27.69,25.91
SIG1
  Top 0.406: R13.2 32.51,40.64 30.35,42.8 30.35,44.32 28.96,45.72 26.92,45.72 25.91,46.74
  Top 0.61: U$3.7 26.29,38.57 R7.1 C19.1 25.91,40.98 25.91,46.74 25.91,56.39 21.01,61.29 D7.4
SIG2  (via drill 0.41)
  Top 0.406: R14.2 21.34,35.05 v22.23,35.94 | v26.16,33.78 27.05,33.78 27.56,34.29 U$3.6
  Top 0.61: D12.4 27.9,40.95 C20.1 R8.1 27.56,38.57 U$3.6
  Bottom 0.406: v22.23,35.94 24,35.94 v26.16,33.78
SWCLK  (via drill 0.3)
  Top 0.305: v3.56,22.35 2.23,22.35 JP3.2 | v24.71,16 25,16 U4.37
  Bottom 0.305: v24.71,16 22.61,16 20.83,17.78 8.13,17.78 v3.56,22.35
SWDIO  (via drill 0.3)
  Top 0.305: U4.34 22.07,18.06 v21.34,18.8 | v3.56,24.13 3.56,24.38 2.79,25.15 1.98,25.15 JP3.4
  Bottom 0.305: v21.34,18.8 8.89,18.8 v3.56,24.13
USART1_RX  (via drill 0.3)
  Top 0.305: U4.31 21.59,19.56 v21.34,19.81 | v7.37,21.82 7.37,22.8 JP3.1
  Bottom 0.305: v21.34,19.81 9.4,19.81 v7.37,21.82
USART1_TX  (via drill 0.3)
  Top 0.305: U4.30 22.61,20.06 v21.84,20.83 | v8.13,24.13 7.62,24.64 7.62,25.2 JP3.3
  Bottom 0.305: v21.84,20.83 11.43,20.83 v8.13,24.13
VBUS  (via drill 0.41)
  Top 0.203: 12.06,6.99 12.06,6.36 D3.A
  Top 0.406: JP1.VBUS 11.09,7.96 12.06,6.99 12.06,7.83 R10.2 | JP4.VBUS 14.31,82.64 v12.57,80.9
  Top 0.813: R10.2 12.95,8.89 v11.43,10.41 | v12.57,80.9 12.57,82.04 10.41,84.2 5.32,84.2 JP2.VIN0
  Bottom 0.813: v11.43,10.41 3.43,10.41 1.02,12.83 1.02,61.98 12.57,73.53 v12.57,80.9

### Text on the board
tNames: 5V DC | PJ13 | GND | 5V | GND | 33V | DIO | TX | CLK | RX | POWER
bNames: Nov 18 2015 | Rijn